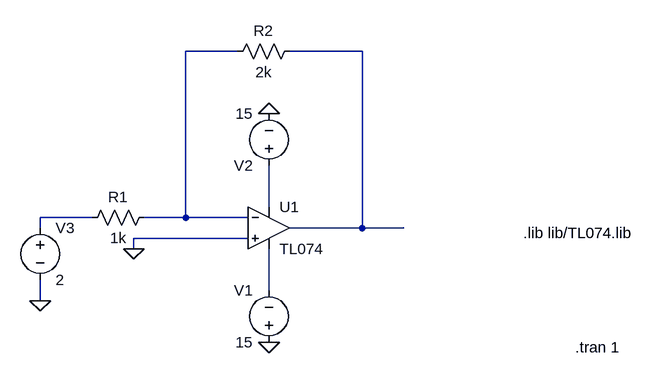
[diagram p0: schematic teste_ampop.asc]
teste_ampop.asc, the LTspice schematic file:
Version 4.1
SHEET 1 880 680
WIRE 64 -176 -16 -176
WIRE 256 -176 144 -176
WIRE 112 64 112 0
WIRE -160 80 -240 80
WIRE -16 80 -16 -176
WIRE -16 80 -80 80
WIRE 80 80 -16 80
WIRE -240 96 -240 80
WIRE 256 96 256 -176
WIRE 256 96 144 96
WIRE 320 96 256 96
WIRE 80 112 -96 112
WIRE -96 128 -96 112
WIRE 112 192 112 128
WIRE -240 208 -240 176
FLAG 112 272 0
FLAG 112 -80 0
FLAG -96 128 0
FLAG -240 208 0
SYMBOL OpAmps\\opamp2 112 32 R0
SYMATTR InstName U1
SYMATTR Value TL074
SYMBOL voltage 112 288 R180
WINDOW 0 24 96 Left 2
WINDOW 3 24 16 Left 2
WINDOW 123 0 0 Left 0
WINDOW 39 0 0 Left 0
SYMATTR InstName V1
SYMATTR Value 15
SYMBOL voltage 112 16 R180
WINDOW 123 0 0 Left 0
WINDOW 39 0 0 Left 0
SYMATTR InstName V2
SYMATTR Value 15
SYMBOL res -64 64 R90
WINDOW 0 0 56 VBottom 2
WINDOW 3 32 56 VTop 2
SYMATTR InstName R1
SYMATTR Value 1k
SYMBOL res 160 -192 R90
WINDOW 0 0 56 VBottom 2
WINDOW 3 32 56 VTop 2
SYMATTR InstName R2
SYMATTR Value 2k
SYMBOL voltage -240 80 R0
WINDOW 123 0 0 Left 0
WINDOW 39 0 0 Left 0
SYMATTR InstName V3
SYMATTR Value 2
TEXT 504 104 Left 2 !.lib lib/TL074.lib
TEXT 584 280 Left 2 !.tran 1

The netlist it stands for:
* teste_ampop.asc
X§U1 0 N001 N003 N005 N002 TL074  ; pins In+ In- V+ V- OUT
V1 0 N005 15
V2 N003 0 15
R1 N001 N004 1k
R2 N002 N001 2k
V3 N004 0 2
.lib lib/TL074.lib
.tran 1
.backanno
.end